# Altium schematic sheet Sheet1.SchDoc
size A4; SheetNumber: 1; SheetTotal: 1
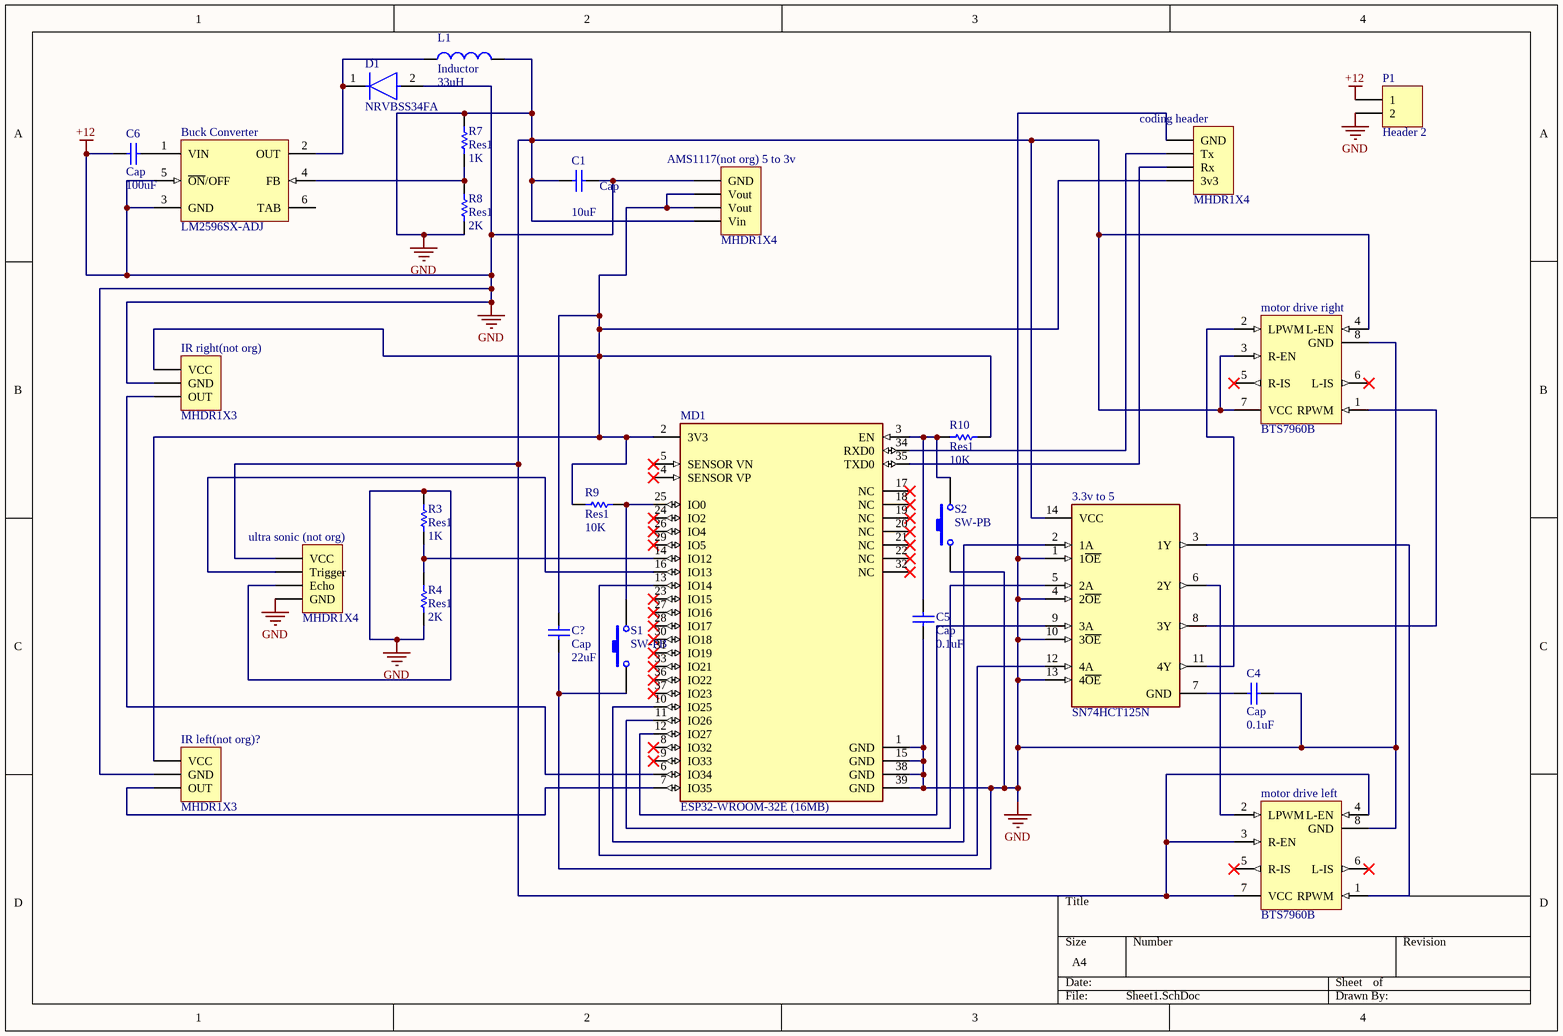
[diagram p0: Sheet1.SchDoc]

## Parts
3.3v_to_5  SN74HCT125N  [FP-N0014A-MFG]
AMS1117(not_org)_5_to_3v  MHDR1X4  [MHDR1X4]
Buck_Converter  LM2596SX-ADJ  [KTT0005B_N]
C1  Cap  value 10uF  [RAD-0.3]
C4  Cap  value 0.1uF  [RAD-0.3]
C5  Cap  value 0.1uF  [RAD-0.3]
C6  Cap  value 100uF  [RAD-0.3]
C?  Cap  value 22uF  [RAD-0.3]
coding_header  MHDR1X4  [MHDR1X4]
D1  NRVBSS34FA  [FP-425AB-MFG]
IR_left(not_org)?  MHDR1X3  [MHDR1X3]
IR_right(not_org)  MHDR1X3  [MHDR1X3]
L1  Inductor  value 33uH  [0402-A]
MD1  ESP32-WROOM-32E (16MB)  [FP-ESP32-WROOM-32E_16MB-MFG]
motor_drive_left  BTS7960B  [INF-P-TO-263-7-6_M]
motor_drive_right  BTS7960B  [INF-P-TO-263-7-6_M]
P1  Header 2  [HDR1X2]
R3  Res1  value 1K  [AXIAL-0.3]
R4  Res1  value 2K  [AXIAL-0.3]
R7  Res1  value 1K  [AXIAL-0.3]
R8  Res1  value 2K  [AXIAL-0.3]
R9  Res1  value 10K  [AXIAL-0.3]
R10  Res1  value 10K  [AXIAL-0.3]
S1  SW-PB  [SPST-2]
S2  SW-PB  [SPST-2]
ultra_sonic_(not_org)  MHDR1X4  [MHDR1X4]

## Nets
+12: 3.3v_to_5.1(1~{OE}) 3.3v_to_5.4(2~{OE}) 3.3v_to_5.10(3~{OE}) 3.3v_to_5.13(4~{OE}) 3.3v_to_5.14(VCC) AMS1117(not_org)_5_to_3v.1(GND) AMS1117(not_org)_5_to_3v.4(Vin) Buck_Converter.3(GND) Buck_Converter.5(~{ON}/OFF) C1.1 C1.2 C4.2 C5.1 C6.1 C?.2 coding_header.1(GND) D1.2(A) IR_left(not_org)?.2(GND) IR_right(not_org).2(GND) L1.2 MD1.1(GND) MD1.15(GND) MD1.38(GND) MD1.39(GND) motor_drive_left.3(R-EN) motor_drive_left.4(L-EN) motor_drive_left.7(VCC) motor_drive_left.8(GND) motor_drive_right.3(R-EN) motor_drive_right.4(L-EN) motor_drive_right.7(VCC) motor_drive_right.8(GND) P1.1 P1.2 R3.2 R4.1 R7.2 R8.1 S1.1 S2.1 ultra_sonic_(not_org).1(VCC) ultra_sonic_(not_org).3(Echo) ultra_sonic_(not_org).4(GND)  [also labelled GND]
Net3.3v_to_5_2: 3.3v_to_5.2(1A) MD1.10(IO25)
Net3.3v_to_5_3: 3.3v_to_5.3(1Y) motor_drive_left.1(RPWM)
Net3.3v_to_5_5: 3.3v_to_5.5(2A) MD1.11(IO26)
Net3.3v_to_5_6: 3.3v_to_5.6(2Y) motor_drive_left.2(LPWM)
Net3.3v_to_5_7: 3.3v_to_5.7(GND) C4.1
Net3.3v_to_5_8: 3.3v_to_5.8(3Y) motor_drive_right.1(RPWM)
Net3.3v_to_5_9: 3.3v_to_5.9(3A) MD1.12(IO27)
Net3.3v_to_5_11: 3.3v_to_5.11(4Y) motor_drive_right.2(LPWM)
Net3.3v_to_5_12: 3.3v_to_5.12(4A) MD1.13(IO14)
NetAMS1117(not_org)_5_to_3v_2: AMS1117(not_org)_5_to_3v.2(Vout) AMS1117(not_org)_5_to_3v.3(Vout) C?.1 coding_header.4(3v3) IR_left(not_org)?.1(VCC) IR_right(not_org).1(VCC) MD1.2(3V3) R9.1 R10.2
NetBuck_Converter_1: Buck_Converter.1(VIN) C6.2
NetBuck_Converter_2: Buck_Converter.2(OUT) D1.1(C) L1.1
NetBuck_Converter_4: Buck_Converter.4(FB) R7.1 R8.2
NetC5_2: C5.2 MD1.3(EN) R10.1 S2.2
Netcoding_header_2: coding_header.2(Tx) MD1.34(RXD0)
Netcoding_header_3: coding_header.3(Rx) MD1.35(TXD0)
NetIR_left(not_org)?_3: IR_left(not_org)?.3(OUT) MD1.7(IO35)
NetIR_right(not_org)_3: IR_right(not_org).3(OUT) MD1.6(IO34)
NetMD1_14: MD1.14(IO12) R3.1 R4.2
NetMD1_16: MD1.16(IO13) ultra_sonic_(not_org).2(Trigger)
NetMD1_25: MD1.25(IO0) R9.2 S1.2

Not connected (* = marked no-connect by the designer): Buck_Converter 6(TAB); MD1 4(SENSOR_VP)* 5(SENSOR_VN)* 8(IO32)* 9(IO33)* 17(NC)* 18(NC)* 19(NC)* 20(NC)* 21(NC)* 22(NC)* 23(IO15)* 24(IO2)* 26(IO4)* 27(IO16)* 28(IO17)* 29(IO5)* 30(IO18)* 31(IO19)* 32(NC)* 33(IO21)* 36(IO22)* 37(IO23)*; motor_drive_left 5(R-IS)* 6(L-IS)*; motor_drive_right 5(R-IS)* 6(L-IS)*

## Library data of the parts
3.3v_to_5 = CMP-0440-00136-4: IC BUF NON-INVERT 5.5V 14DIP; Quiescent Current: 8uA; Number of Bits: 4; Propagation Delay: 32ns; Turn-On Delay Time: 50ns; Low Level Output Current: 6mA; Logic Function: Buffer; Number of Bits per Element: 1; Min Supply Voltage: 4.5V; Operating Supply Voltage: 5V; High Level Output Current: -6mA; Polarity: Non-Inverting; Radiation Hardening: No; Number of Inputs: 4; Case/Package: PDIP; Number of Input Lines: 4; Mount: Through Hole; Number of Pins: 14; Package Quantity: 25; Number of Circuits: 4; Number of Output Lines: 4; Packaging: Rail/Tube; REACH SVHC: No SVHC; Lead Free: Lead Free; Termination: Through Hole; Max Operating Temperature: 85°C; Number of Channels: 4; Number of Elements: 4; Min Operating Temperature: -40°C; Max Supply Voltage: 5.5V; Number of Outputs: 4
AMS1117(not_org)_5_to_3v coding_header ultra_sonic_(not_org) = MHDR1X4: Header, 4-Pin; LatestRevisionDate: 17-Jul-2002; LatestRevisionNote: Re-released for DXP Platform.; Publisher: Altium Limited
Buck_Converter = CMP-0069-00285-3: SIMPLE SWITCHER® Power Converter 150 KHz 3A Step-Down Voltage Regulator, 5-pin TO-263; Manufacturer: Texas Instruments; PackageTopMarking: NSUZXYTTE#*LM2596S*-ADJ P+; PowerWise: N; PackageDescription: TO-263, Molded, .400 x .390 x .180in, 5 Lead, .067in Pitch, Surface Mount; RoHS: N; Code_JEDEC: MO-169-AB; CompType: Switcher; ComponentLink1Description: Datasheet URL; PackageReference: KTT0005B; PinCount: 5; ComponentLink1URL: http://www.ti.com/general/docs/lit/getliterature.tsp?genericPartNumber=LM2596&fileType=pdf
C1 C4-C6 C? = Cap: Capacitor; Published: 8-Jun-2000; LatestRevisionDate: 17-Jul-2002; LatestRevisionNote: Re-released for DXP Platform.; PackageReference: RAD-0.3; Publisher: Altium Limited; PackageDescription: Radial Cap, Thru-Hole; 2 Leads; 0.3 in Pin Spacing
D1 = CMP-00278-103808874-1: NRVBSS34FA Schottky Barrier Rectifier Diode 40V 3A 2-Pin SOD−123FL T/R; Manufacturer Lifecycle Status: ACTIVE; Max Junction Temperature (Tj): 125°C; Capacitance: 152pF; Peak Reverse Current: 500µA; Max Forward Surge Current (Ifsm): 80A; RoHS: Compliant; Forward Current: 3A; Height: 1.43mm; Max Operating Temperature: 125°C; Min Operating Temperature: -55°C; Lifecycle Status: Production; Max Repetitive Reverse Voltage (Vrrm): 40V; Reverse Voltage: 40V; NexarPartId: 103808874
IR_left(not_org)? IR_right(not_org) = MHDR1X3: Header, 3-Pin; LatestRevisionDate: 17-Jul-2002; LatestRevisionNote: Re-released for DXP Platform.; Publisher: Altium Limited
L1 = Inductor: Code_IEC: 1005; Published: 8-Jun-2000; LatestRevisionDate: 29-May-2009; LatestRevisionNote: IPC-7351 Footprint Added.; PackageReference: 0402-A; Publisher: Altium Limited; PackageDescription: Chip Inductor; Code_JEITA: 0402
MD1 = CMP-194065-000027-1: RX TXRX MOD WIFI TRACE ANT SMD
motor_drive_left motor_drive_right = CMP-1114-00025-1: High Current PN Half Bridge NovalithIC, -40 to 150 degC, P-TO-263-7-6; Manufacturer: Infineon; Iq (typ): 7 uA; Green: FALSE; ComponentLink1Description: Manufacturer URL; Halogen-free: FALSE; PackageDescription: 7-Pin Plastic Transistor Single Outline Package, 9.9 x 9.2 mm Body, 1.27 mm Pitch; ComponentLink2Description: Datasheet; ComponentLink3Description: Package Specification; ComponentLink1URL: http://www.infineon.com/; ComponentLink2URL: http://www.infineon.com/dgdl/BTS7960_Datasheet.pdf?folderId=db3a304412b407950112b408e8c90004&fileId=db3a304412b407950112b43945006d5d&location=en.Products.Automotive_ICs.Motor_Drivers__Automotive_.Integrated_High_Current_Motor_Drivers__NovalithIC____Trilith; ComponentLink3URL: http://www.infineon.com/dgdl/BTS7970B_Datasheet.pdf?folderId=db3a304412b407950112b408e8c90004&fileId=db3a304412b407950112b43949b36d61&sId=db3a30433d68e984013d7db637dc5e6a; PackageReference: P-TO-263-7-6; PackageVersion: May-06; Mounting Technology: Surface Mount; RevisionNote: Re-Activated Devices; PartNumber: BTS7960B; DatasheetVersion: Rev. 1.1
P1 = Header 2: Header, 2-Pin; LatestRevisionDate: 17-Jul-2002; LatestRevisionNote: Re-released for DXP Platform.; Publisher: Altium Limited
R3 R4 R7-R10 = Res1: Resistor; Published: 8-Jun-2000; LatestRevisionDate: 17-Jul-2002; LatestRevisionNote: Re-released for DXP Platform.; PackageReference: AXIAL-0.3; Publisher: Altium Limited; PackageDescription: Axial Device, Thru-Hole; 2 Leads; 0.3 in Pin Spacing
S1 S2 = SW-PB: Switch; Published: 24-Mar-1999; LatestRevisionDate: 17-Jul-2002; LatestRevisionNote: Re-released for DXP Platform.; PackageReference: SPST-2; Publisher: Altium Limited; PackageDescription: Switch; 2 Leads